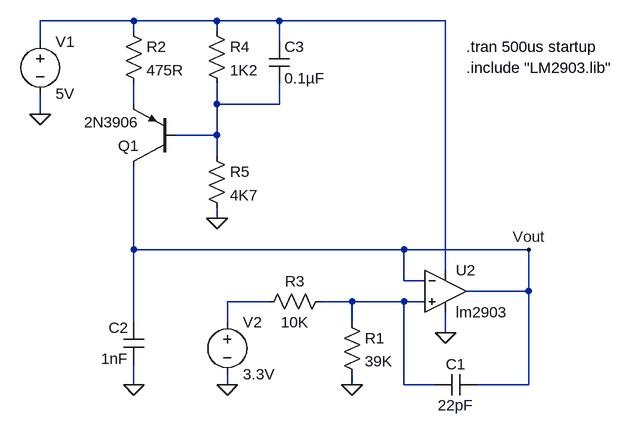
[diagram p0: schematic saw tooth-discrete.asc]
saw tooth-discrete.asc, the LTspice schematic file:
Version 4
SHEET 1 1496 1284
WIRE -2640 -192 -2784 -192
WIRE -2512 -192 -2640 -192
WIRE -2416 -192 -2512 -192
WIRE -2160 -192 -2416 -192
WIRE -2640 -176 -2640 -192
WIRE -2512 -176 -2512 -192
WIRE -2784 -160 -2784 -192
WIRE -2416 -160 -2416 -192
WIRE -2640 -64 -2640 -96
WIRE -2512 -64 -2512 -96
WIRE -2416 -64 -2416 -96
WIRE -2416 -64 -2512 -64
WIRE -2784 -48 -2784 -80
WIRE -2512 -16 -2512 -64
WIRE -2512 -16 -2576 -16
WIRE -2512 16 -2512 -16
WIRE -2512 112 -2512 96
WIRE -2640 160 -2640 32
WIRE -2224 160 -2640 160
WIRE -2032 160 -2224 160
WIRE -2160 192 -2160 -192
WIRE -2224 208 -2224 160
WIRE -2192 208 -2224 208
WIRE -2032 224 -2032 160
WIRE -2032 224 -2128 224
WIRE -2432 240 -2496 240
WIRE -2304 240 -2352 240
WIRE -2224 240 -2304 240
WIRE -2192 240 -2224 240
WIRE -2640 272 -2640 160
WIRE -2496 272 -2496 240
WIRE -2304 272 -2304 240
WIRE -2160 288 -2160 256
WIRE -2640 368 -2640 336
WIRE -2496 368 -2496 352
WIRE -2304 368 -2304 352
WIRE -2224 368 -2224 240
WIRE -2176 368 -2224 368
WIRE -2032 368 -2032 224
WIRE -2032 368 -2112 368
FLAG -2160 288 0
FLAG -2784 -48 0
FLAG -2512 112 0
FLAG -2640 368 0
FLAG -2032 160 Vout
FLAG -2304 368 0
FLAG -2496 368 0
SYMBOL Opamps\\opamp2 -2160 160 R0
SYMATTR InstName U2
SYMATTR Value lm2903
SYMBOL voltage -2784 -176 R0
WINDOW 123 0 0 Left 2
WINDOW 39 0 0 Left 2
SYMATTR InstName V1
SYMATTR Value 5V
SYMBOL res -2656 -192 R0
SYMATTR InstName R2
SYMATTR Value 475R
SYMBOL cap -2624 336 R180
WINDOW 0 24 56 Left 2
WINDOW 3 24 8 Left 2
SYMATTR InstName C2
SYMATTR Value 1nF
SYMBOL pnp -2576 32 R180
SYMATTR InstName Q1
SYMATTR Value 2N3906
SYMBOL res -2528 -192 R0
SYMATTR InstName R4
SYMATTR Value 1K2
SYMBOL res -2528 0 R0
SYMATTR InstName R5
SYMATTR Value 4K7
SYMBOL cap -2432 -160 R0
SYMATTR InstName C3
SYMATTR Value 0.1µF
SYMBOL voltage -2496 256 R0
WINDOW 123 0 0 Left 2
WINDOW 39 0 0 Left 2
SYMATTR InstName V2
SYMATTR Value 3.3V
SYMBOL res -2320 256 R0
SYMATTR InstName R1
SYMATTR Value 39K
SYMBOL res -2336 224 R90
WINDOW 0 0 56 VBottom 2
WINDOW 3 32 56 VTop 2
SYMATTR InstName R3
SYMATTR Value 10K
SYMBOL cap -2112 352 R90
WINDOW 0 0 32 VBottom 2
WINDOW 3 32 32 VTop 2
SYMATTR InstName C1
SYMATTR Value 22pF
TEXT -2128 -120 Left 2 !.include "LM2903.lib"
TEXT -2128 -152 Left 2 !.tran 500us startup

The netlist it stands for:
* saw tooth-discrete.asc
XU2 N005 Vout N001 0 Vout lm2903  ; pins In+ In- V+ V- OUT
V1 N001 0 5V
R2 N001 N002 475R
C2 0 Vout 1nF
Q1 Vout N003 N002 0 2N3906
R4 N001 N003 1K2
R5 N003 0 4K7
C3 N001 N003 0.1µF
V2 N004 0 3.3V
R1 N005 0 39K
R3 N005 N004 10K
C1 Vout N005 22pF
.model NPN NPN
.model PNP PNP
.lib standard.bjt
.include "LM2903.lib"
.tran 500us startup
.backanno
.end